# EAGLE design PentaFnord_PowerLedBoard_0_1 (EAGLE 5.12)
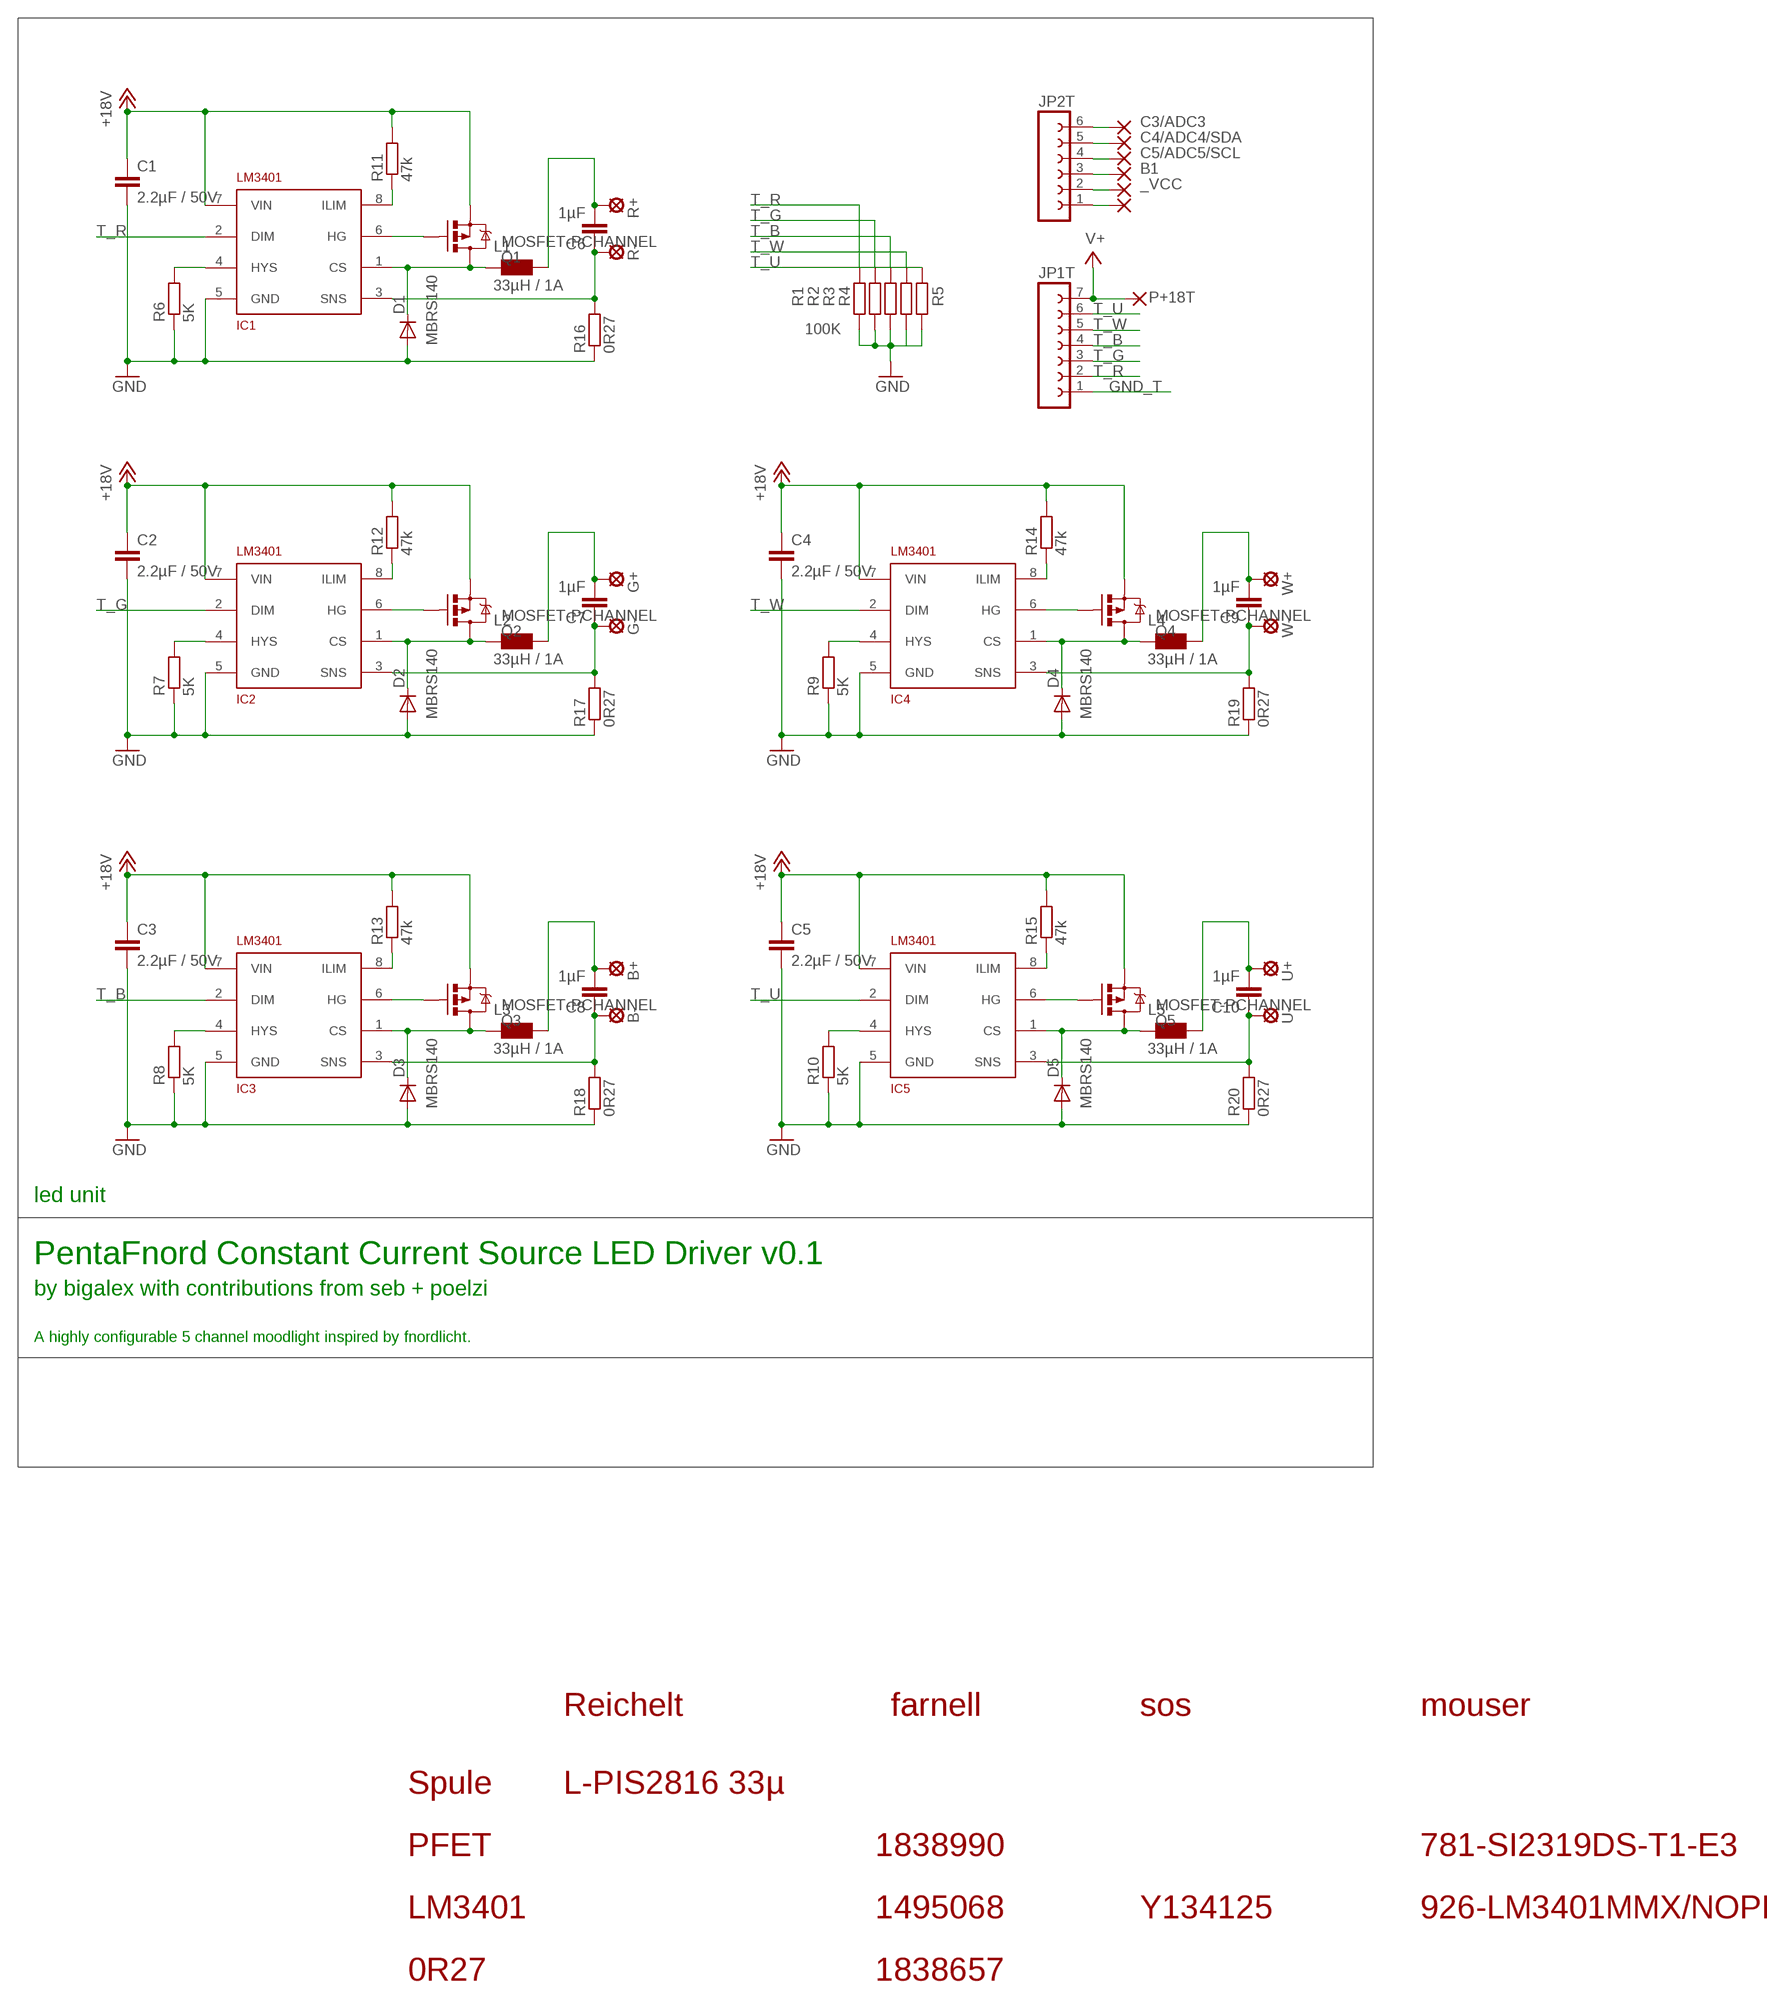
[diagram p0: schematic, sheet 1]

## Parts
B+  SE14  [SE14]
B-  SE14  [SE14]
C1  2.2µF / 50V  C-EUC1210  [C1210]
C2  2.2µF / 50V  C-EUC1210  [C1210]
C3  2.2µF / 50V  C-EUC1210  [C1210]
C4  2.2µF / 50V  C-EUC1210  [C1210]
C5  2.2µF / 50V  C-EUC1210  [C1210]
C6  1µF  CAP0805  [0805]
C7  1µF  CAP0805  [0805]
C8  1µF  CAP0805  [0805]
C9  1µF  CAP0805  [0805]
C10  1µF  CAP0805  [0805]
D1  MBRS140  DIODE-SMB  [SMB]
D2  MBRS140  DIODE-SMB  [SMB]
D3  MBRS140  DIODE-SMB  [SMB]
D4  MBRS140  DIODE-SMB  [SMB]
D5  MBRS140  DIODE-SMB  [SMB]
G+  SE14  [SE14]
G-  SE14  [SE14]
IC1  LM3401  [MSOP8]
IC2  LM3401  [MSOP8]
IC3  LM3401  [MSOP8]
IC4  LM3401  [MSOP8]
IC5  LM3401  [MSOP8]
JP1T  FE07-1  [FE07]
JP2T  FE06-1  [FE06]
L1  33µH / 1A  WE-TI_S/M  [WE-TI_S/M]
L2  33µH / 1A  WE-TI_S/M  [WE-TI_S/M]
L3  33µH / 1A  WE-TI_S/M  [WE-TI_S/M]
L4  33µH / 1A  WE-TI_S/M  [WE-TI_S/M]
L5  33µH / 1A  WE-TI_S/M  [WE-TI_S/M]
P+5T  WIREPAD2,54/0,8  [2,54/0,8]
P+18T  WIREPAD2,54/0,8  [2,54/0,8]
PB1T  WIREPAD2,54/0,8  [2,54/0,8]
PC3T  WIREPAD2,54/0,8  [2,54/0,8]
PC4T  WIREPAD2,54/0,8  [2,54/0,8]
PC5T  WIREPAD2,54/0,8  [2,54/0,8]
PGNDT1  WIREPAD2,54/0,8  [2,54/0,8]
Q1  MOSFET-PCHANNEL  [SOT23]
Q2  MOSFET-PCHANNEL  [SOT23]
Q3  MOSFET-PCHANNEL  [SOT23]
Q4  MOSFET-PCHANNEL  [SOT23]
Q5  MOSFET-PCHANNEL  [SOT23]
R1  100K  R-EU_R0402  [R0402]
R2  100K  R-EU_R0402  [R0402]
R3  100K  R-EU_R0402  [R0402]
R4  100K  R-EU_R0402  [R0402]
R5  100K  R-EU_R0402  [R0402]
R6  5K  R-EU_R0402  [R0402]
R7  5K  R-EU_R0402  [R0402]
R8  5K  R-EU_R0402  [R0402]
R9  5K  R-EU_R0402  [R0402]
R10  5K  R-EU_R0402  [R0402]
R11  47k  R-EU_R0402  [R0402]
R12  47k  R-EU_R0402  [R0402]
R13  47k  R-EU_R0402  [R0402]
R14  47k  R-EU_R0402  [R0402]
R15  47k  R-EU_R0402  [R0402]
R16  0R27  R-EU_R1206  [R1206]
R17  0R27  R-EU_R1206  [R1206]
R18  0R27  R-EU_R1206  [R1206]
R19  0R27  R-EU_R1206  [R1206]
R20  0R27  R-EU_R1206  [R1206]
R+  SE14  [SE14]
R-  SE14  [SE14]
U+  SE14  [SE14]
U-  SE14  [SE14]
W+  SE14  [SE14]
W-  SE14  [SE14]

## Nets
+18V: C1.1 C2.1 C3.1 C4.1 C5.1 IC1.7(VIN) IC2.7(VIN) IC3.7(VIN) IC4.7(VIN) IC5.7(VIN) JP1T.7 P+18T.1(P) Q1.2(S) Q2.2(S) Q3.2(S) Q4.2(S) Q5.2(S) R11.2 R12.2 R13.2 R14.2 R15.2 ; supply symbol labelled V+
_VCC: JP2T.2 P+5T.1(P)
B1: JP2T.3 PB1T.1(P)
C3/ADC3: JP2T.6 PC3T.1(P)
C4/ADC4/SDA: JP2T.5 PC4T.1(P)
C5/ADC5/SCL: JP2T.4 PC5T.1(P)
GND_T: C1.2 C2.2 C3.2 C4.2 C5.2 D1.A D2.A D3.A D4.A D5.A IC1.5(GND) IC2.5(GND) IC3.5(GND) IC4.5(GND) IC5.5(GND) JP1T.1 JP2T.1 PGNDT1.1(P) R1.2 R2.2 R3.2 R4.2 R5.2 R6.1 R7.1 R8.1 R9.1 R10.1 R16.1 R17.1 R18.1 R19.1 R20.1 ; supply symbol labelled GND
N$1: C6.1 IC1.3(SNS) R16.2 R-.MP
N$2: C6.2 L1.1 R+.MP
N$3: D1.C IC1.1(CS) L1.2 Q1.3(D)
N$4: C9.1 IC4.3(SNS) R19.2 W-.MP
N$5: IC1.4(HYS) R6.2
N$6: C9.2 L4.1 W+.MP
N$7: IC1.8(ILIM) R11.1
N$8: D4.C IC4.1(CS) L4.2 Q4.3(D)
N$9: IC4.4(HYS) R9.2
N$10: IC1.6(HG) Q1.1(G)
N$11: IC4.8(ILIM) R14.1
N$12: IC4.6(HG) Q4.1(G)
N$13: B-.MP C8.1 IC3.3(SNS) R18.2
N$14: B+.MP C8.2 L3.1
N$15: D3.C IC3.1(CS) L3.2 Q3.3(D)
N$16: IC3.4(HYS) R8.2
N$17: IC3.8(ILIM) R13.1
N$18: C10.1 IC5.3(SNS) R20.2 U-.MP
N$19: C10.2 L5.1 U+.MP
N$20: IC3.6(HG) Q3.1(G)
N$21: C7.1 G-.MP IC2.3(SNS) R17.2
N$22: C7.2 G+.MP L2.1
N$23: D2.C IC2.1(CS) L2.2 Q2.3(D)
N$24: IC2.4(HYS) R7.2
N$25: IC2.8(ILIM) R12.1
N$26: IC2.6(HG) Q2.1(G)
N$27: D5.C IC5.1(CS) L5.2 Q5.3(D)
N$28: IC5.4(HYS) R10.2
N$29: IC5.8(ILIM) R15.1
N$30: IC5.6(HG) Q5.1(G)
T_B: IC3.2(DIM) JP1T.4 R3.1
T_G: IC2.2(DIM) JP1T.3 R2.1
T_R: IC1.2(DIM) JP1T.2 R1.1
T_U: IC5.2(DIM) JP1T.6 R5.1
T_W: IC4.2(DIM) JP1T.5 R4.1

## Notes on the sheet
- led unit
- PentaFnord Constant Current Source LED Driver v0.1
- by bigalex with contributions from seb + poelzi
- A highly configurable 5 channel moodlight inspired by fnordlicht.
- Reichelt | farnell | sos | mouser
- Spule | L-PIS2816 33µ
- PFET | 1838990 | 781-SI2319DS-T1-E3
- LM3401 | 1495068 | Y134125 | 926-LM3401MMX/NOPB
- 0R27 | 1838657

## Library data of the parts
B+ B- G+ G- R+ R- U+ U- W+ W- = solpad:SE14: SOLDER PAD E1553, drill 1,4mm, distributor Buerklin, 07F820
C1-C5 = rcl:C-EU: CAPACITOR, European symbol
C6-C10 = SparkFun:CAP: Capacitor Standard 0603 ceramic capacitor, and 0.1" leaded capacitor.
D1-D5 = diode:DIODE-: DIODE
IC1-IC5 = seb:LM3401
JP1T = con-lsta:FE07-1: FEMALE HEADER; OC_FARNELL: unknown; OC_NEWARK: unknown
JP2T = con-lsta:FE06-1: FEMALE HEADER; OC_FARNELL: unknown; OC_NEWARK: unknown
L1-L5 = wuerth-elektronik:WE-TI: Radial Leaded Wire Wound Inductor WE-TI A low-cost storage/filtering possibility in comparison to SMD versions - Radial through-hole inductor - High saturation core material -- Signal filtering -- NF-switches
P+5T P+18T PB1T PC3T PC4T PC5T PGNDT1 = wirepad:WIREPAD: Wire PAD connect wire on PCB
Q1-Q5 = SparkFun:MOSFET-PCHANNEL
R1-R20 = rcl:R-EU_: RESISTOR, European symbol

## Board
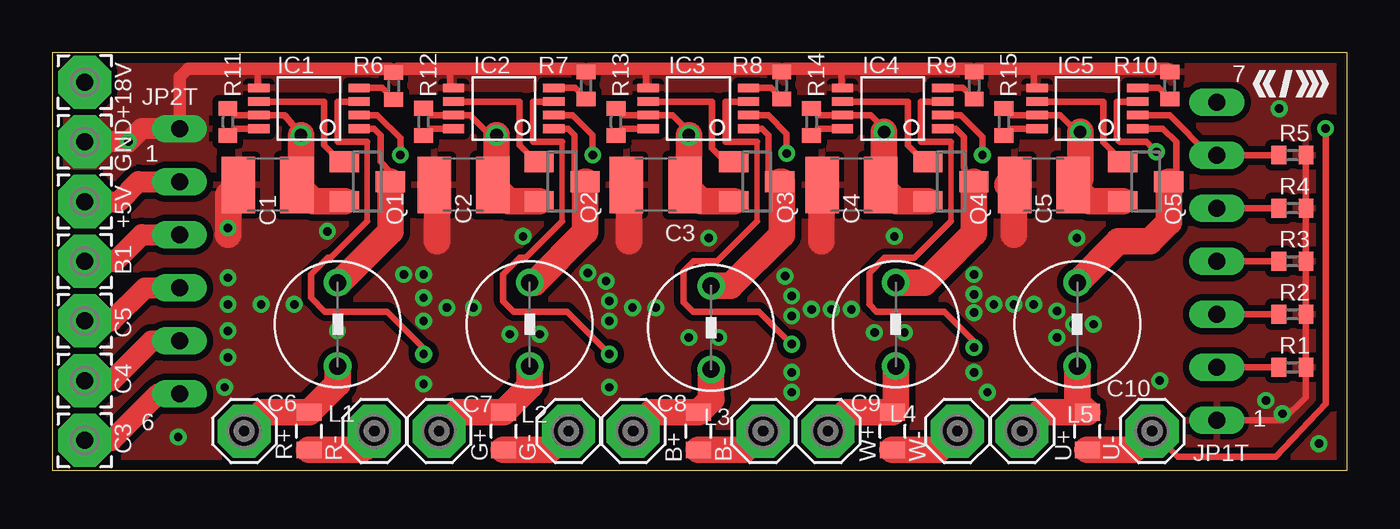
[diagram p1: board, top side]
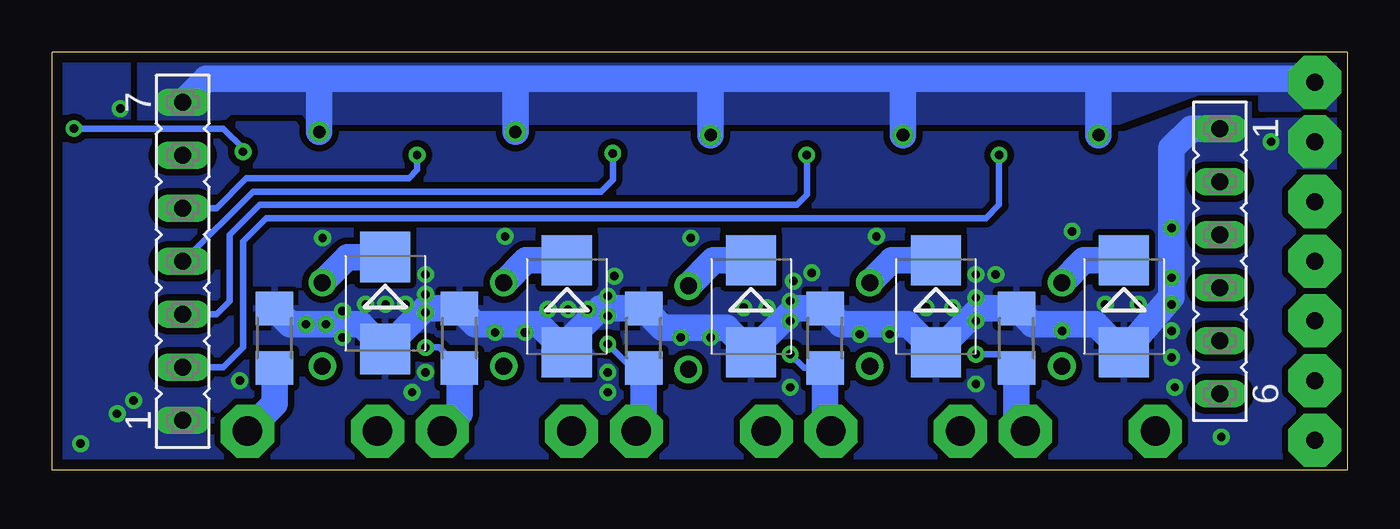
[diagram p2: board, bottom side, seen from below]

Size 62 x 20 mm. Coordinates in mm from the lower left corner, seen from the top.
Outline: 0,0 62,0 62,20 0,20 0,0
Copper layers (1*16): Top 0.035mm / dielectric 1.5mm / Bottom 0.035mm
Design rules "default *": minimum track width 10mil, minimum drill 0.4mm, track to track 10mil, track to pad 10mil, pad to pad 8mil, via to via 10mil, smd to smd 8mil, copper to edge 20mil, drill to drill 8mil, minimum pad ring 10mil, minimum via ring 8mil, stop-mask expansion 4mil, vias tented up to drill 40mil, thermal gap 10mil

### Footprints (pad centres in the part's own frame; a part is rotated, then mirrored left to right if it is on the bottom)
SE14 = drill 1.397 pad 2.54 octagon: MP 0,0
C1210 = smd 1.6 x 2.7: 1 -1.4,0; 2 1.4,0
0805 = smd 0.8 x 1.2: 1 -0.9,0; 2 0.9,0
SMB = smd 2.4 x 2.4: A 2.2,0; C -2.2,0
MSOP8 = smd 0.41 x 1.02: 1 -0.975,-2.4; 2 -0.325,-2.4; 3 0.325,-2.4; 4 0.975,-2.4; 5 0.975,2.4; 6 0.325,2.4; 7 -0.325,2.4; 8 -0.975,2.4
FE07 = drill 0.813 long: 1 -7.62,0; 2 -5.08,0; 3 -2.54,0; 4 0,0; 5 2.54,0; 6 5.08,0; 7 7.62,0
FE06 = drill 0.813 long: 1 -6.35,0; 2 -3.81,0; 3 -1.27,0; 4 1.27,0; 5 3.81,0; 6 6.35,0
WE-TI_S/M = drill 0.813 round: 1 -2,0; 2 2,0
2,54/0,8 = drill 0.813 pad 2.54 octagon: 1 0,0
SOT23 = smd 1 x 1.4: 1 -0.95,-1.1; 2 0.95,-1.1; 3 0,1.1
R0402 = smd 0.7 x 0.9: 1 -0.65,0; 2 0.65,0
R1206 = smd 1.6 x 1.803: 1 -1.422,0; 2 1.422,0

### Placement (x,y rotation side)
B+  27.81,1.87 0 top
B-  34.04,1.87 0 top
C1  10.32,13.65 180 top
C2  19.68,13.65 180 top
C3  28.89,13.65 180 top
C4  38.26,13.65 180 top
C5  47.47,13.65 180 top
C6  12.29,1.87 90 top
C7  21.62,1.87 90 top
C8  30.94,1.87 90 top
C9  40.23,1.87 90 top
C10  49.56,1.87 90 top
D1  10.69,7.84 270 bottom
D2  19.7,7.84 270 bottom
D3  28.54,7.84 270 bottom
D4  37.36,7.84 270 bottom
D5  46.06,8 270 bottom
G+  18.52,1.87 0 top
G-  24.71,1.87 0 top
IC1  12.29,17.32 90 top
IC2  21.62,17.32 90 top
IC3  30.94,17.32 90 top
IC4  40.23,17.32 90 top
IC5  49.56,17.32 90 top
JP1T  55.75,10 90 bottom
JP2T  6.1,10 270 bottom
L1  13.67,6.98 90 top
L2  22.86,6.98 90 top
L3  31.55,6.82 90 top
L4  40.39,6.98 90 top
L5  49.07,6.98 90 top
P+5T  1.56,12.86 0 top
P+18T  1.56,18.57 0 top
PB1T  1.56,10 0 top
PC3T  1.56,1.43 0 top
PC4T  1.56,4.29 0 top
PC5T  1.56,7.14 0 top
PGNDT1  1.56,15.72 0 top
Q1  15.09,13.81 270 top
Q2  24.41,13.81 270 top
Q3  33.73,13.81 270 top
Q4  43.03,13.81 270 top
Q5  52.35,13.81 270 top
R1  59.37,4.92 0 top
R2  59.37,7.46 0 top
R3  59.37,10 0 top
R4  59.37,12.54 0 top
R5  59.37,15.08 0 top
R6  16.35,18.38 270 top
R7  25.56,18.42 270 top
R8  34.92,18.42 270 top
R9  44.13,18.42 270 top
R10  53.5,18.42 270 top
R11  8.41,16.67 90 top
R12  17.78,16.67 90 top
R13  26.99,16.67 90 top
R14  36.35,16.67 90 top
R15  45.56,16.67 90 top
R16  15.84,6.32 270 bottom
R17  25,6.32 270 bottom
R18  33.69,6.32 270 bottom
R19  42.51,6.32 270 bottom
R20  51.36,6.32 270 bottom
R+  9.19,1.87 0 top
R-  15.42,1.87 0 top
U+  46.43,1.87 0 top
U-  52.65,1.87 0 top
W+  37.13,1.87 0 top
W-  43.33,1.87 0 top

### Tracks (layer width: path | path; a pad name or v marks a point on that pad's centre or on a via)
+18V  (via drill 0.6)
  Top 0.305: v11.91,16.03 11.27,16.83 11.12,16.98 IC1.7 8.74,16.99 R11.2 | R14.2 36.68,16.99 IC4.7 39.21,16.99 39.85,16.35 v39.83,16.19 | R13.2 27.32,16.99 IC3.7 29.69,16.99 30.48,16.19 v30.48,16.03 | R15.2 45.89,16.99 IC5.7 48.26,16.99 49.05,16.19 v49.21,16.19 | R12.2 18.11,16.99 IC2.7 20,16.99 20.96,16.03 v21.27,16.03
  Top 1.27: v11.91,16.03 11.91,13.65 C1.1 12.51,12.86 Q1.2 | v21.27,16.03 21.27,13.65 C2.1 21.88,12.86 Q2.2 | v30.48,16.03 30.48,13.81 C3.1 31.08,12.86 Q3.2 | v39.83,16.19 39.83,14.1 C4.1 40.45,12.86 Q4.2 | v49.21,16.19 49.21,13.94 C5.1 49.66,12.86 Q5.2
  Bottom 1.27: P+18T.1 1.71,18.73 11.91,18.73 | 11.91,18.73 21.27,18.73 | v11.91,16.03 11.91,18.73 | 21.27,18.73 v21.27,16.03 | 30.48,18.73 v30.48,16.03 | 21.27,18.73 30.48,18.73 | 30.48,18.73 39.83,18.73 | 39.83,18.73 49.21,18.73 | 39.83,18.73 v39.83,16.19 | 49.21,18.73 v49.21,16.19 | 49.21,18.73 54.64,18.73 JP1T.7
  pour Bottom (no thermals): 54.29,16.35 57.78,16.35 57.78,20.16 -0.32,20.16 -0.32,17.3 4.13,17.3 4.13,18.1 7.14,18.1 10.95,16.67 48.9,16.67 49.69,16.83 50.01,17.15 53.5,17.15
_VCC
  Top 1.016: JP2T.2 4.13,13.81 3.18,12.86 P+5T.1
B1
  Top 1.016: JP2T.3 4.29,11.27 3.02,10 PB1T.1
C3/ADC3
  Top 1.016: JP2T.6 5.08,3.65 2.86,1.43 PC3T.1
C4/ADC4/SDA
  Top 1.016: JP2T.5 4.76,6.19 2.86,4.29 PC4T.1
C5/ADC5/SCL
  Top 1.016: JP2T.4 4.44,8.73 2.86,7.14 PC5T.1
GND_T  (via drill 0.4)
  Top 0.305: IC1.5 9.84,18.34 9.84,19.21 | IC2.5 19.05,18.46 19.05,19.21 | IC3.5 28.42,18.41 28.42,19.21 | IC4.5 37.78,18.34 37.78,19.21 | IC5.5 46.99,18.46 46.99,19.21 | JP1T.1 58.89,2.38 60.01,3.49 60.01,5.07 R1.2 R2.2 R3.2 R4.2 R5.2
  Top 0.61: JP2T.1 6.1,18.8 6.51,19.21 9.84,19.21 16.18,19.21 R6.1 16.53,19.21 19.05,19.21 25.42,19.21 R7.1 25.7,19.21 28.42,19.21 34.78,19.21 R8.1 35.07,19.21 37.78,19.21 43.99,19.21 R9.1 44.28,19.21 46.99,19.21 53.36,19.21 R10.1
  Top 1.016: JP2T.1 4.29,16.35 v3.65,15.72 PGNDT1.1
  Top 1.27: C1.2 8.41,13.15 8.41,11.27 | 45.72,13.65 C5.2 46.04,13.62 46.04,11.27 | C2.2 18.42,13.52 18.42,10.95 | C3.2 27.62,13.52 27.62,10.95 | 36.83,10.95 36.83,13.62 C4.2
  Bottom 1.27: JP2T.1 7.46,16.35 8.41,15.4 8.41,8.28 D1.A 12.04,6.99 15.08,6.99 R16.1 17.6,7.74 D2.A 21.04,6.99 24.25,6.99 R17.1 26.44,7.74 D3.A 29.73,6.83 32.77,6.83 R18.1 35.76,7.74 37.61,5.89 | JP1T.1 55.25,2.38 | R20.1 50.6,6.99 47.24,6.99 D5.A 44.12,7.74 R19.1 41.75,6.99 38.71,6.99 37.61,5.89 | 37.61,5.89 D4.A
  other vias: 6.03,1.59 60.64,1.27 58.9,2.7 58.74,17.3 8.41,11.59 8.41,9.21 8.26,3.97 8.41,7.94 10,7.94 13.18,11.43 13.65,6.67 11.59,7.94 8.41,6.67 8.41,5.4 17.78,4.13 17.78,7.14 17.78,8.25 17.78,9.37 16.83,9.37 18.89,7.78 20.16,7.78 22.54,11.19 21.91,6.51 23.34,6.51 26.67,3.97 26.67,7.14 26.67,8.1 26.51,9.05 25.64,9.45 27.78,7.78 28.89,7.78 30.48,6.35 31.91,6.35 31.43,11.11 35.4,4.68 35.4,3.73 35.4,7.38 35.4,8.33 35.08,9.29 36.35,7.7 37.31,7.7 38.26,7.7 39.37,6.59 40.8,6.59 40.32,11.19 44.13,4.68 44.77,3.73 44.13,7.54 44.13,9.37 44.13,8.41 45.09,7.94 46.04,7.94 46.99,7.94 48.1,7.62 48.1,6.35 48.9,6.98 49.85,6.98 49.05,11.11 53.02,4.29 58.1,3.33
  pour Bottom (isolate 0.305, rank 2): 0,20 62,20 62,0 0,0
  pour Top (isolate 0.305, rank 2): 0,20 62,20 62,0 0,0
  pour Bottom (no thermals): 54.77,3.49 57.94,3.49 57.94,2.86 57.94,1.11 55.56,1.11 54.77,1.11
  pour Top (no thermals): -0.48,16.67 3.81,16.67 3.81,14.61 -0.48,14.61
  pour Top (no thermals): 4.45,17.46 7.3,17.46 7.3,15.24 4.45,15.24
  pour Bottom (no thermals): 4.76,17.15 7.3,17.15 7.3,15.24 4.76,15.24
  pour Bottom (no thermals): -0.48,16.67 3.81,16.67 3.81,14.61 -0.48,14.61
N$1  (via drill 0.4)
  Top 0.254: 15.08,11.91 15.08,15.72
  Top 0.305: 15.08,15.72 13.65,15.72 13.65,17.62 14.62,17.62 IC1.3 | 15.08,11.91 13.33,10.16 13.18,10.16 12.39,9.38 12.39,8.24 13.05,7.59 16.03,7.59 17.78,5.84 v17.78,5.56
  Top 1.27: C6.1 14.52,0.97 arc90 R-.MP
  Bottom 0.305: v17.78,5.56 16.5,5.56 R16.2
  Bottom 1.27: R16.2 15.84,2.29 R-.MP
N$2
  Top 1.27: R+.MP 10.09,2.77 C6.2 13.67,4.15 L1.1
N$3
  Top 0.305: IC1.1 14.7,16.35 15.4,16.35 15.72,16.03 15.72,14.76 16.19,14.29 Q1.3
  Top 1.27: Q1.3 16.19,11.43 13.74,8.98 L1.2
  Bottom 1.27: D1.C 12.6,10.04 L1.2
N$4  (via drill 0.4)
  Top 0.254: 43.03,11.91 43.03,15.72
  Top 0.305: IC4.3 41.59,17.64 41.59,15.72 43.03,15.72 | 43.03,11.91 41.28,10.16 39.85,10.16 39.12,9.43 39.12,7.94 39.47,7.59 42.7,7.59 44.13,6.16 v44.13,5.87
  Top 1.27: C9.1 42.43,0.97 W-.MP
  Bottom 0.305: v44.13,5.87 43.48,5.87 R19.2
  Bottom 1.27: R19.2 42.51,2.7 W-.MP
N$5
  Top 0.305: 16.21,17.77 R6.2 15.79,18.29 IC1.4
N$6
  Top 1.27: W+.MP 38.03,2.77 C9.2 40.39,2.93 L4.1
N$7
  Top 0.305: IC1.8 8.74,16.34 R11.1
N$8
  Top 0.305: IC4.1 43.27,16.34 43.66,15.95 43.66,14.52 arc67 Q4.3
  Top 1.27: Q4.3 44.13,11.35 41.76,8.98 L4.2
  Bottom 1.27: D4.C 39.32,10.04 L4.2
N$9
  Top 0.305: IC4.4 43.61,18.29 R9.2
N$10
  Top 0.305: 13.65,14.76 Q1.1 13.81,14.76 13.02,15.56 13.02,17.62 9.83,17.62 IC1.6
N$11
  Top 0.305: IC4.8 36.68,16.34 R14.1
N$12
  Top 0.305: 41.59,14.76 Q4.1 41.75,14.76 40.96,15.56 40.96,17.64 IC4.6
N$13  (via drill 0.4)
  Top 0.254: 33.73,11.91 33.73,15.72
  Top 0.305: IC3.3 32.23,17.64 32.23,15.72 33.73,15.72 | 33.73,11.91 31.83,10 30.7,10 30.23,9.53 30.23,8.03 30.67,7.59 33.85,7.59 v35.4,6.03
  Top 1.27: B-.MP 33.14,0.97 C8.1
  Bottom 0.305: v35.4,6.03 34.27,4.9 R18.2
  Bottom 1.27: R18.2 33.69,2.22 B-.MP
N$14
  Top 1.27: C8.2 | B+.MP 28.71,2.77 C8.2 | C8.2 31.56,3.4 31.55,3.41 L3.1
N$15
  Top 0.305: IC3.1 33.98,16.34 34.29,16.03 34.29,14.35 Q3.3
  Top 1.27: Q3.3 34.92,13.81 34.92,11.27 32.47,8.82 L3.2
  Bottom 1.27: D3.C 30.34,10.04 31.55,8.83 L3.2
N$16
  Top 0.305: IC3.4 34.4,18.29 R8.2
N$17
  Top 0.305: IC3.8 27.31,16.34 R13.1
N$18  (via drill 0.4)
  Top 0.305: IC5.3 50.96,17.64 50.96,15.88 51.12,15.72 52.39,15.72 v52.86,15.24 | 52.35,2.18 U-.MP 53.89,0.64 58.58,0.64 60.96,3.18 v60.96,16.35
  Top 1.27: C10.1 51.75,0.97 U-.MP
  Bottom 0.305: v60.96,16.35 53.82,16.35 52.86,15.4 v52.86,15.24
  Bottom 1.27: R20.2 51.36,3.17 U-.MP
N$19
  Top 1.27: U+.MP 47.33,2.77 C10.2 49.07,3.26 L5.1
N$20
  Top 0.305: IC3.6 31.59,17.64 31.59,15.4 32.23,14.76 Q3.1
N$21  (via drill 0.4)
  Top 0.254: 24.41,11.91 24.41,15.72
  Top 0.305: IC2.3 23.02,17.64 23.02,15.72 24.41,15.72 | 24.41,11.91 22.66,10.16 22.38,10.16 21.59,9.37 21.59,8.1 22.1,7.59 24.64,7.59 v26.67,5.56
  Top 1.27: C7.1 23.81,0.97 G-.MP
  Bottom 0.305: v26.67,5.56 26.01,4.9 R17.2
  Bottom 1.27: R17.2 25,2.16 G-.MP
N$22
  Top 1.27: G+.MP 19.42,2.77 C7.2 22.87,4.03 22.86,4.04 L2.1
N$23
  Top 0.305: IC2.1 24.7,16.34 25,16.03 25,14.32 Q2.3
  Top 1.27: 25.56,13.81 Q2.3 25.51,11.4 23.09,8.98 L2.2
  Bottom 1.27: D2.C 21.81,10.04 22.86,8.99 L2.2
N$24
  Top 0.305: IC2.4 25.03,18.29 R7.2
N$25
  Top 0.305: IC2.8 18.1,16.34 R12.1
N$26
  Top 0.305: IC2.6 22.38,17.64 22.38,15.56 23.18,14.76 Q2.1
N$27
  Top 0.305: Q5.3 53.82,14.18 53.82,15.72 53.18,16.35 IC5.1
  Top 1.27: 53.5,13.81 Q5.3 53.45,11.86 52.55,10.95 51.05,10.95 L5.2
  Bottom 1.27: D5.C 47.85,10.2 L5.2
N$28
  Top 0.305: IC5.4 52.97,18.29 R10.2
N$29
  Top 0.305: IC5.8 45.88,16.34 R15.1
N$30
  Top 0.305: 50.93,15.08 Q5.1 50.32,15.69 50.32,17.62 47.18,17.62 IC5.6
T_B  (via drill 0.4)
  Top 0.305: IC3.2 34.28,16.99 35.16,16.11 v35.16,15.16 | R3.1 JP1T.4
  Bottom 0.305: JP1T.4 55.72,10 52.39,13.34 35.72,13.34 35.16,13.89 v35.16,15.16
T_G  (via drill 0.4)
  Top 0.305: IC2.2 24.92,16.99 25.88,16.03 v25.88,15.08 | R2.1 JP1T.3
  Bottom 0.305: v25.88,15.08 25.88,13.18 26.35,12.7 52.07,12.7 53.5,11.27 53.5,8.1 54.14,7.46 JP1T.3
T_R  (via drill 0.4)
  Top 0.305: IC1.2 15.55,16.99 16.67,15.88 v16.67,15.08 | R1.1 JP1T.2
  Bottom 0.305: v16.67,15.08 16.67,12.7 17.3,12.07 51.75,12.07 52.86,10.95 52.86,5.87 53.82,4.92 JP1T.2
T_U
  Top 0.305: R5.1 JP1T.6 55.41,15.08 53.5,16.99 53.02,16.99 IC5.2
T_W  (via drill 0.4)
  Top 0.305: IC4.2 43.49,16.99 44.53,15.95 v44.53,15.08 | R4.1 JP1T.5
  Bottom 0.305: JP1T.5 54.14,12.54 52.7,13.97 44.93,13.97 44.53,14.37 v44.53,15.08

### Text on the board
tNames: 7 | +18V | 1 | GND | +5V | B1 | C5 | C4 | 6 | 1 | C3
bStop: PowerLedBoard 0.1 | PentaFnord | R | G | B | W | U